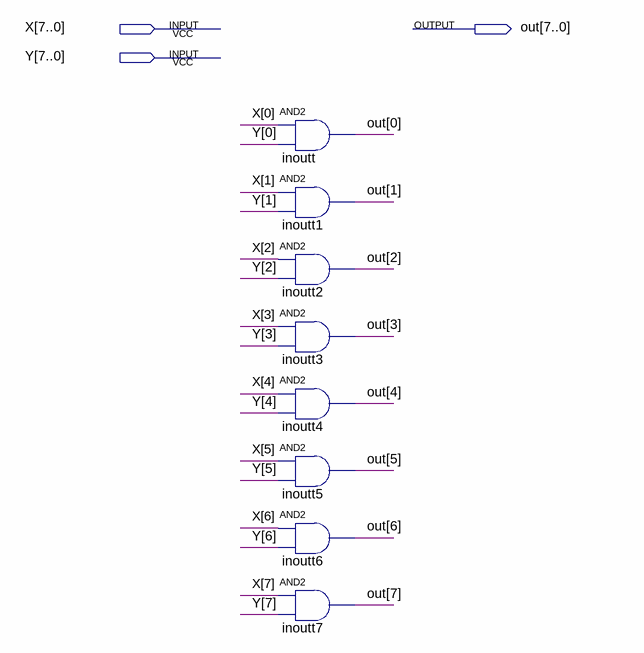
[diagram p0: schematic sheet]
// Quartus schematic AND_op.bdf as structural Verilog: 8 symbols, 3 pins
module AND_op (
  input  [7:0] X,
  input  [7:0] Y,
  output [7:0] out
);

  and inoutt (out[0], X[0], Y[0]);
  and inoutt1 (out[1], X[1], Y[1]);
  and inoutt2 (out[2], X[2], Y[2]);
  and inoutt3 (out[3], X[3], Y[3]);
  and inoutt4 (out[4], X[4], Y[4]);
  and inoutt5 (out[5], X[5], Y[5]);
  and inoutt6 (out[6], X[6], Y[6]);
  and inoutt7 (out[7], X[7], Y[7]);
endmodule
